# Altium schematic sheet PD.SchDoc
size A4; SheetNumber: 1; SheetTotal: 1
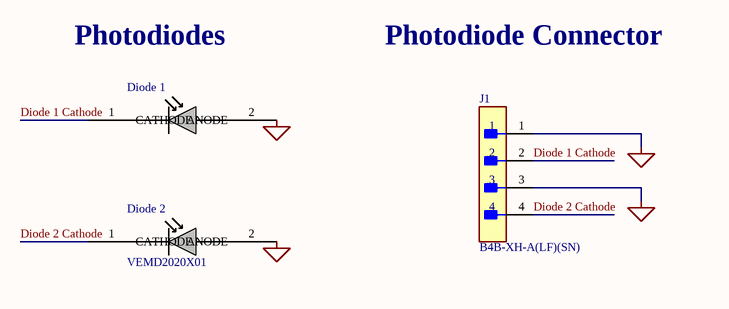
[diagram p0: PD.SchDoc]

## Parts
Diode_1  VEMD2020X01  [6p544-5383p02-4_VIS]  (value not drawn)
Diode_2  VEMD2020X01  [6p544-5383p02-4_VIS]
J1  B4B-XH-A(LF)(SN)  [FP-B4B-XH-A_LF_SN-MFG]

## Nets
GND: Diode_1.2(ANODE) Diode_2.2(ANODE) J1.1 J1.3
Diode 1 Cathode: Diode_1.1(CATHODE) J1.2
Diode 2 Cathode: Diode_2.1(CATHODE) J1.4

## Notes on the sheet
- Photodiodes
- Photodiode Connector

## Library data of the parts
Diode_1 Diode_2 = VEMD2020X01: No Description Available; Mfr_Name: Vishay; RefDes: RefDes; Type: Type
J1 = CMP-17439-000250-1: CONN HEADER VERT 4POS 2.5MM; Number of Contacts: 4; Contact Resistance: 20mR; Voltage Rating: 250V; Max Current Rating: 3A; Gender: Male; Wire/Cable Gauge: 22AWG; Mated Stacking Heights: 9.8mm; Insulation Resistance: 1GR; Orientation: Straight; Contact Type: Male Pin; Contact Finish - Mating: TIN; Series: XH; Max Voltage Rating (AC): 250V; Lead Pitch: 2.5mm; Contact Shape: Square; Insulation Color: Natural; Termination: Solder; Lead Free: Lead Free; Voltage Rating (AC): 250V; Number of Rows: 1; Flammability Rating: UL94 V-0; Number of Positions: 4; Max Operating Temperature: 85°C; Package Quantity: 500; Mount: Through Hole; REACH SVHC: No SVHC; Connector Type: Header; Insulation Material: Nylon; Fastening Type: Detent; Min Operating Temperature: -25°C; Housing Color: White; Packaging: Bulk; Contact Plating: Tin; Contact Material: Brass; Max Voltage Rating (DC): 250V; Housing Material: Polyamide; Color: Natural; Material: Polyamide; Pitch: 2.5mm; Depth: 5.75mm; Current Rating: 3A; Length: 12.4mm